# EAGLE schematic Arm controller (EAGLE 9.2.1)
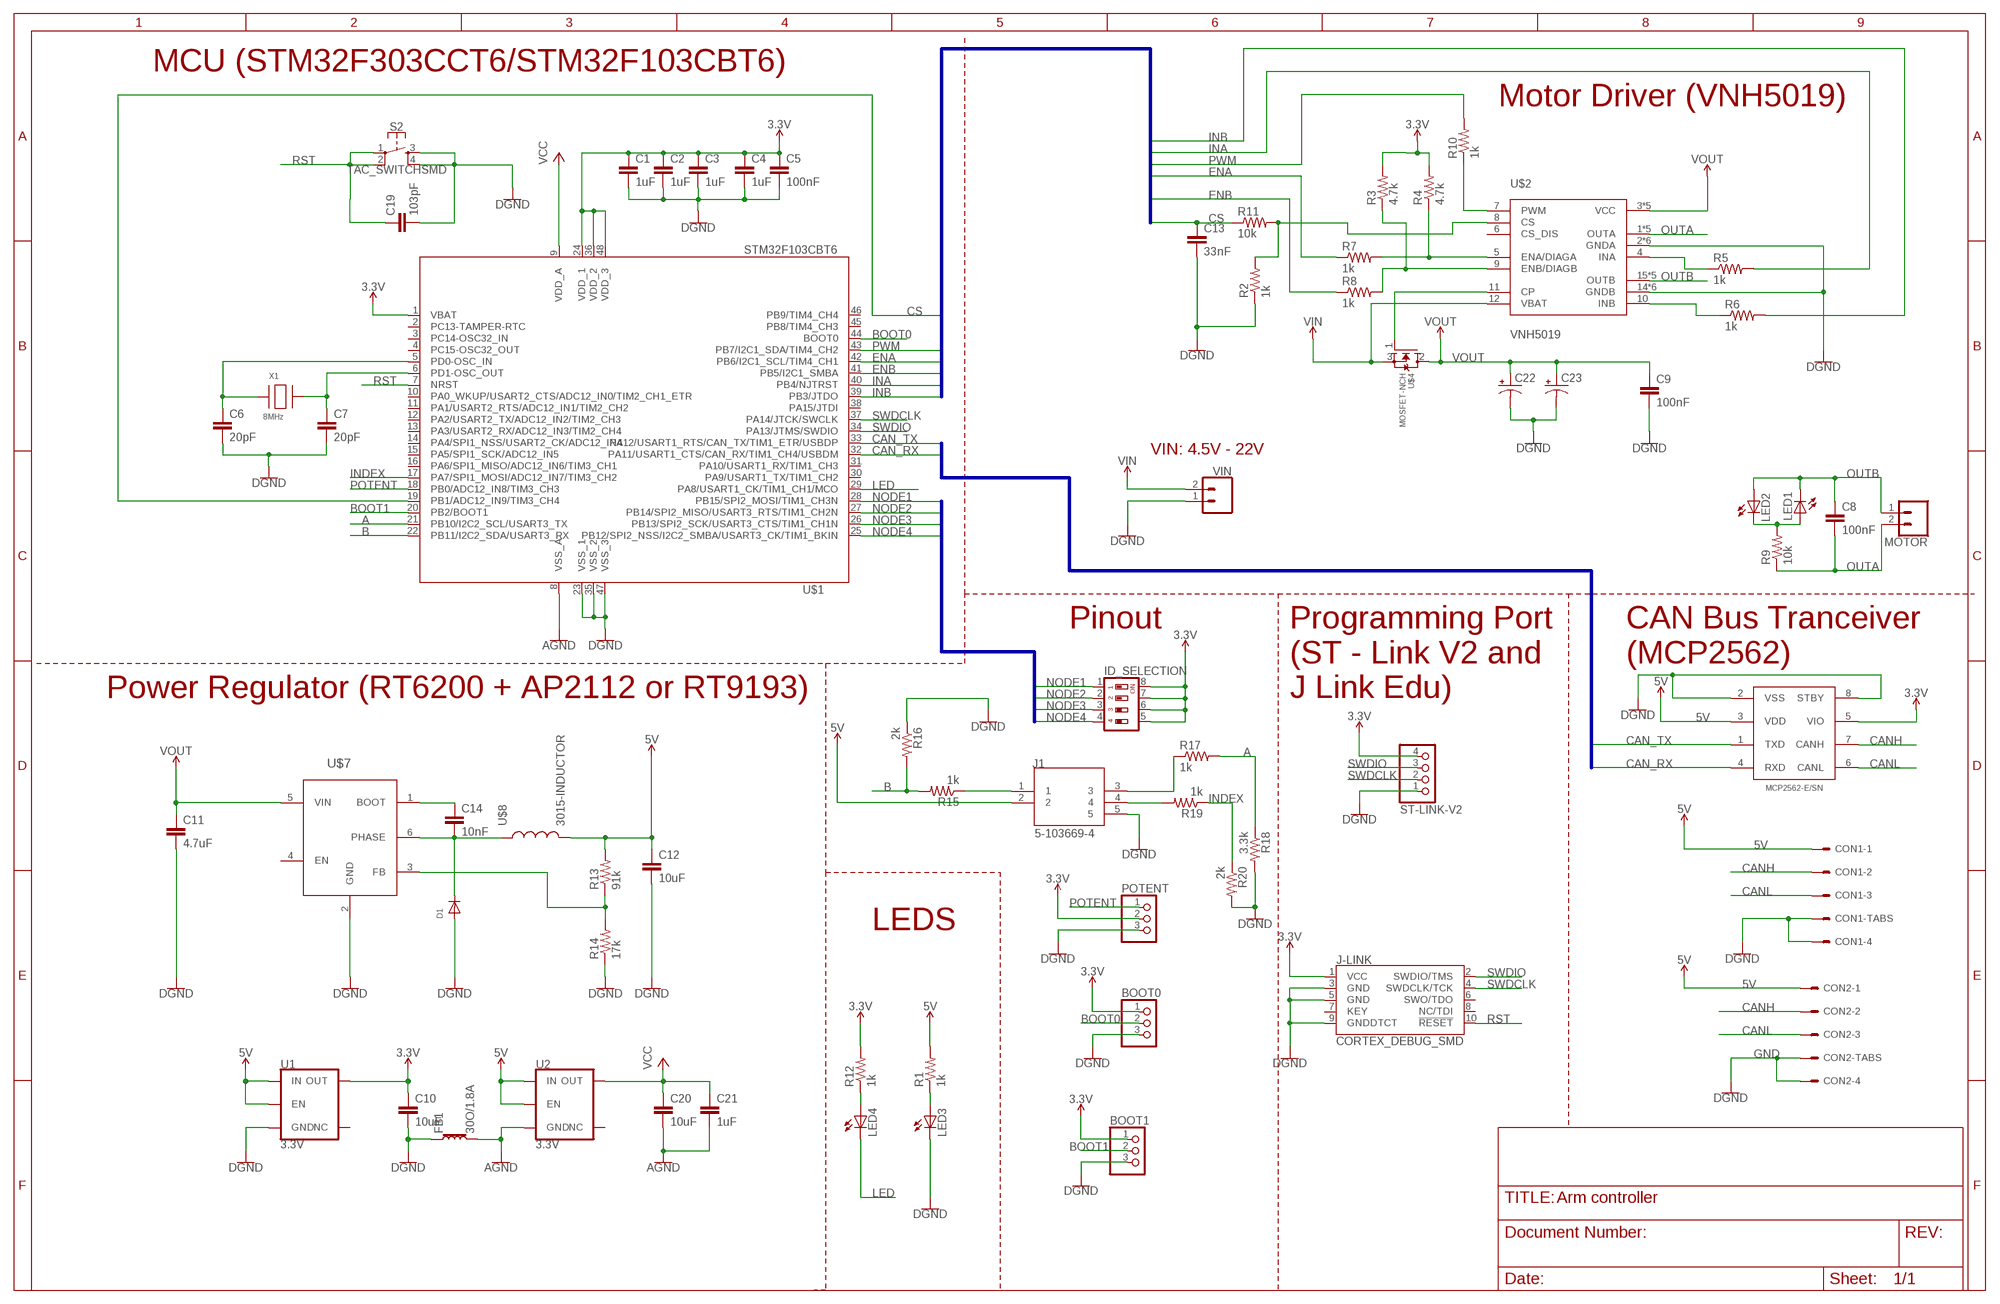
[diagram p0: schematic, sheet 1]

## Parts
BOOT0  PINHD-1X3  [1X03]
BOOT1  PINHD-1X3  [1X03]
C1  1uF  C-EUC0805  [C0805]
C2  1uF  C-EUC0805  [C0805]
C3  1uF  C-EUC0805  [C0805]
C4  1uF  C-EUC0805  [C0805]
C5  100nF  C-EUC0805  [C0805]
C6  20pF  C-EUC0805  [C0805]
C7  20pF  C-EUC0805  [C0805]
C8  100nF  C-EUC1206  [C1206]
C9  100nF  C-EUC0805  [C0805]
C10  10uF  C-EUC1206  [C1206]
C11  4.7uF  C-EUC0805  [C0805]
C12  10uF  C-EUC0805  [C0805]
C13  33nF  C-EUC0805  [C0805]
C14  10nF  C-EUC0805  [C0805]
C19  103pF  C-EUC0805  [C0805]
C20  10uF  C-EUC1206  [C1206]
C21  1uF  C-EUC0805  [C0805]
C22  CPOL-USCT7343  [CT7343]
C23  CPOL-USCT7343  [CT7343]
CON1  SM04B-GHS-TB  [SM04B-GHS-TB]
CON2  SM04B-GHS-TB  [SM04B-GHS-TB]
D1  DIODESOD-123  [SOD-123]
FB1  30O/1.8A  FERRITE_BEAD-0603  [0603]
ID_SELECTION  SMS-004  [SMS-004]
J1  5-103669-4  [TE_5-103669-4]
J-LINK  CORTEX_DEBUG_SMD  [SAMTECH_FTSH-105-01]
LED1  LEDCHIPLED_0805  [CHIPLED_0805]
LED2  LEDCHIPLED_0805  [CHIPLED_0805]
LED3  LEDCHIPLED_0805  [CHIPLED_0805]
LED4  LEDCHIPLED_0805  [CHIPLED_0805]
MOTOR  CONN_025MM  [SCREWTERMINAL-5MM-2]
POTENT  PINHD-1X3  [1X03]
R1  1k  R-US_R0805  [R0805]
R2  1k  R-US_R0805  [R0805]
R3  4.7k  R-US_R0805  [R0805]
R4  4.7k  R-US_R0805  [R0805]
R5  1k  R-US_R0805  [R0805]
R6  1k  R-US_R0805  [R0805]
R7  1k  R-US_R0805  [R0805]
R8  1k  R-US_R0805  [R0805]
R9  10k  R-US_R0805  [R0805]
R10  1k  R-US_R0805  [R0805]
R11  10k  R-US_R0805  [R0805]
R12  1k  R-US_R0805  [R0805]
R13  91k  R-US_R0805  [R0805]
R14  17k  R-US_R0805  [R0805]
R15  1k  R-US_R0805  [R0805]
R16  2k  R-US_R0805  [R0805]
R17  1k  R-US_R0805  [R0805]
R18  3.3k  R-US_R0805  [R0805]
R19  1k  R-US_R0805  [R0805]
R20  2k  R-US_R0805  [R0805]
S2  TAC_SWITCHSMD  MOMENTARY-SWITCH-SPST-2-SMD-5.2MM  [TACTILE_SWITCH_SMD_5.2MM]
ST-LINK-V2  PINHD-1X4  [1X04]
U1  3.3V  V_REG_AP2112K-3.3V  [SOT23-5]
U2  3.3V  V_REG_AP2112K-3.3V  [SOT23-5]
U$1  STM32F103CBT6  [STM32_LQFP48]
U$2  VNH5019  [MULTIPOWERSO-30]
U$3  MCP2562-E/SN  [SOIC8]
U$4  MOSFET-NCH  [TO252-3]
U$7  RT6200  [TSOT23-6]
U$8  3015-INDUCTOR  [3015]
VIN  CONN_025MM  [SCREWTERMINAL-5MM-2]
X1  8MHz  XTALNX5032  [NX5032]

## Nets
1: R4.1 R7.2 U$2.5(ENA/DIAGA)
2: R3.1 R8.2 U$2.9(ENB/DIAGB)
3.3V: BOOT0.1 BOOT1.1 C1.1 C2.1 C3.1 C4.1 C5.1 C10.1 ID_SELECTION.5 ID_SELECTION.6 ID_SELECTION.7 ID_SELECTION.8 J-LINK.1(VCC) POTENT.2 R3.2 R4.2 R12.2 ST-LINK-V2.4 U1.5(OUT) U$1.1(VBAT) U$1.24(VDD_1) U$1.36(VDD_2) U$1.48(VDD_3) U$3.5(VIO)
5V: C12.1 CON1.P$1 CON2.P$1 J1.2 R1.2 R13.2 U1.1(IN) U1.3(EN) U2.1(IN) U2.3(EN) U$3.3(VDD) U$8.2
A: R17.2 R18.1 U$1.21(PB10/I2C2_SCL/USART3_TX)
AGND: C20.2 C21.2 FB1.2 U2.2(GND) U$1.8(VSS_A)
B: R15.2 R16.2 U$1.22(PB11/I2C2_SDA/USART3_RX)
BOOT0: BOOT0.2 U$1.44(BOOT0)
BOOT1: BOOT1.2 U$1.20(PB2/BOOT1)
CAN_RX: U$1.32(PA11/USART1_CTS/CAN_RX/TIM1_CH4/USBDM) U$3.4(RXD)
CAN_TX: U$1.33(PA12/USART1_RTS/CAN_TX/TIM1_ETR/USBDP) U$3.1(TXD)
CANH: CON1.P$2 CON2.P$2 U$3.7(CANH)
CANL: CON1.P$3 CON2.P$3 U$3.6(CANL)
CS: C13.1 R11.1 U$1.19(PB1/ADC12_IN9/TIM3_CH4)
ENA: R7.1 U$1.42(PB6/I2C1_SCL/TIM4_CH1)
ENB: R8.1 U$1.41(PB5/I2C1_SMBA)
GND: BOOT0.3 BOOT1.3 C1.2 C2.2 C3.2 C4.2 C5.2 C6.2 C7.2 C9.2 C10.2 C11.2 C12.2 C13.2 C19.2 C22.- C23.- CON1.P$4 CON1.P$5 CON1.P$6 CON2.P$4 CON2.P$5 CON2.P$6 D1.A FB1.1 J1.5 J-LINK.3(GND) J-LINK.5(GND) J-LINK.9(GNDDTCT) LED3.C POTENT.3 R2.1 R14.1 R16.1 R18.2 R20.2 S2.3 S2.4 ST-LINK-V2.1 U1.2(GND) U$1.23(VSS_1) U$1.35(VSS_2) U$1.47(VSS_3) U$2.2(GNDA) U$2.14(GNDB) U$2.17(GNDB) U$2.18(GNDB) U$2.19(GNDB) U$2.20(GNDB) U$2.22(GNDA) U$2.24(GNDB) U$2.26(GNDA) U$2.27(GNDA) U$2.28(GNDA) U$2.29(GNDA) U$3.2(VSS) U$3.8(STBY) U$7.2(GND) VIN.1 ; supply symbol labelled DGND
INA: R5.2 U$1.40(PB4/NJTRST)
INB: R6.2 U$1.39(PB3/JTDO)
INDEX: R19.1 R20.1 U$1.17(PA7/SPI1_MOSI/ADC12_IN7/TIM3_CH2)
LED: LED4.C U$1.29(PA8/USART1_CK/TIM1_CH1/MCO)
N$1: C6.1 U$1.5(PD0-OSC_IN) X1.P$1
N$2: C7.1 U$1.6(PD1-OSC_OUT) X1.P$2
N$3: LED1.A LED2.C R9.2
N$4: C14.1 U$7.1(BOOT)
N$5: LED4.A R12.1
N$6: C14.2 D1.C U$7.6(PHASE) U$8.1
N$7: J1.1 R15.1
N$8: R13.1 R14.2 U$7.3(FB)
N$9: R5.1 U$2.4(INA)
N$10: R2.2 R11.2 U$2.8(CS)
N$11: J1.3 R17.1
N$12: R6.1 U$2.10(INB)
N$14: U$2.11(CP) U$4.1(G)
N$15: J1.4 R19.2
N$20: R10.1 U$2.7(PWM)
N$22: LED3.A R1.1
NODE1: ID_SELECTION.1 U$1.28(PB15/SPI2_MOSI/TIM1_CH3N)
NODE2: ID_SELECTION.2 U$1.27(PB14/SPI2_MISO/USART3_RTS/TIM1_CH2N)
NODE3: ID_SELECTION.3 U$1.26(PB13/SPI2_SCK/USART3_CTS/TIM1_CH1N)
NODE4: ID_SELECTION.4 U$1.25(PB12/SPI2_NSS/I2C2_SMBA/USART3_CK/TIM1_BKIN)
OUTA: C8.2 MOTOR.2 R9.1 U$2.1(OUTA) U$2.25(OUTA) U$2.30(OUTA) U$2.OUTA U$2.OUTA@1(OUTA)
OUTB: C8.1 LED1.C LED2.A MOTOR.1 U$2.15(OUTB) U$2.16(OUTB) U$2.21(OUTB) U$2.OUTB U$2.OUTB@1(OUTB)
POTENT: POTENT.1 U$1.18(PB0/ADC12_IN8/TIM3_CH3)
PWM: R10.2 U$1.43(PB7/I2C1_SDA/TIM4_CH2)
RST: C19.1 J-LINK.10(!RESET) S2.1 S2.2 U$1.7(NRST)
SWDCLK: J-LINK.4(SWDCLK/TCK) ST-LINK-V2.2 U$1.37(PA14/JTCK/SWCLK)
SWDIO: J-LINK.2(SWDIO/TMS) ST-LINK-V2.3 U$1.34(PA13/JTMS/SWDIO)
VCC: C20.1 C21.1 U2.5(OUT) U$1.9(VDD_A)
VIN: U$2.12(VBAT) U$4.3(S) VIN.2
VOUT: C9.1 C11.1 C22.+ C23.+ U$2.3(VCC) U$2.13(VCC) U$2.23(VCC) U$2.VCC U$2.VCC@1(VCC) U$4.2(D) U$7.5(VIN)
Unconnected: J-LINK.6(SWO/TDO) J-LINK.7(KEY) J-LINK.8(NC/TDI) U1.4(NC) U2.4(NC) U$1.2(PC13-TAMPER-RTC) U$1.3(PC14-OSC32_IN) U$1.4(PC15-OSC32_OUT) U$1.10(PA0_WKUP/USART2_CTS/ADC12_IN0/TIM2_CH1_ETR) U$1.11(PA1/USART2_RTS/ADC12_IN1/TIM2_CH2) U$1.12(PA2/USART2_TX/ADC12_IN2/TIM2_CH3) U$1.13(PA3/USART2_RX/ADC12_IN3/TIM2_CH4) U$1.14(PA4/SPI1_NSS/USART2_CK/ADC12_IN4) U$1.15(PA5/SPI1_SCK/ADC12_IN5) U$1.16(PA6/SPI1_MISO/ADC12_IN6/TIM3_CH1) U$1.30(PA9/USART1_TX/TIM1_CH2) U$1.31(PA10/USART1_RX/TIM1_CH3) U$1.38(PA15/JTDI) U$1.45(PB8/TIM4_CH3) U$1.46(PB9/TIM4_CH4) U$2.6(CS_DIS) U$7.4(EN)

## Buses
CS,ENA,ENB,INA,INB,PWM
NODE1,NODE2,NODE3,NODE4
CAN_RX,CAN_TX

## Notes on the sheet
- MCU (STM32F303CCT6/STM32F103CBT6)
- Motor Driver (VNH5019)
- VIN: 4.5V - 22V
- Pinout
- CAN Bus Tranceiver
  (MCP2562)
- Power Regulator (RT6200 + AP2112 or RT9193)
- Programming Port
  (ST - Link V2 and 
  J Link Edu)
- LEDS

## Library data of the parts
BOOT0 BOOT1 POTENT = pinhead:PINHD-1X3: PIN HEADER
C1-C7 C9 C11-C14 C19 C21 = rcl:C-EU: CAPACITOR, European symbol; SPICEPREFIX: C
C8 C10 C20 = resistor:C-EU: CAPACITOR, European symbol
C22 C23 = rcl:CPOL-US: POLARIZED CAPACITOR, American symbol; SPICEPREFIX: C
CON1 CON2 = SPEAR:SM04B-GHS-TB
D1 = adafruit:DIODE: Diode SMADIODE - SMA Surface Mount Package 20V 1A Schottky Diode Digikey: 641-1014-6-ND DO-1N4148 - Through Hole Small Current Diode SOD-123 20V 1 A (.5mV Vf) Schottky Diode - Digikey: MBRX120TPMSCT-ND SOD-323 10V 570mA (.38mV Vf, 3ns) Schottky Diode - Digikey: ZLLS410CT-ND SOD-523 30V 30mA Schottky Diode (RB751S-40TE61) - Digikey: RB751S-40TE61CT-ND SOT23-R/W - SOT23 Package (R = Solder Paste/Reflow Ovens, W = Hand-Soldering) BAT54Film 40V 300mA - Digikey: 497-7162-1-ND
FB1 = SPEAR:FERRITE_BEAD: Ferrite Bead (blocks, cores, rings, chokes, etc.) Inductor with layers of ferrite used to suppress high frequencies. Often used to isolate high frequency noise. SparkFun Products: IOIO-OTG - V2.2 <https://www.sparkfun.com/products/13613> SparkFun SAMD21 Mini Breakout <https://www.sparkfun.com/products/13664> SparkFun 6 Degrees of Freedom Breakout - LSM6DS3 <https://www.sparkfun.com/products/13339> SparkFun SAMD21 Dev Breakout <https://www.sparkfun.com/products/13672>; PROD_ID: NDUC-13805
ID_SELECTION = SPEAR:SMS-004
J1 = SPEAR:5-103669-4: 05 MTE HDR SRST LATCH W/HLDWN; AVAILABILITY: Unavailable; CENTERLINE_PITCH: 2.54 mm[.1 in]; COMMENT: 5-103669-4; DESCRIPTION: 05 MTE HDR SRST LATCH W/HLDWN; EU_ROHS_COMPLIANCE: Compliant; LINK: http://www.te.com/usa-en/product-5-103669-4.html; MF: TE Connectivity; MP: 5-103669-4; NUMBER_OF_POSITIONS: 5; PACKAGE: None; PRICE: None; PRODUCT_TYPE: Connector
J-LINK = SparkFun-Connectors:CORTEX_DEBUG: Cortex Debug Connector - 10 pin Supports JTAG debug, Serial Wire debug, and Serial Wire Viewer. PTH and SMD connector options available. General Connector Information <http://infocenter.arm.com/help/topic/com.arm.doc.faqs/attached/13634/cortex_debug_connectors.pdf> Products: PTH Connector <http://www.digikey.com/product-detail/en/cnc-tech/3220-10-0100-00/1175-1627-ND/3883661> -via Digi-Key SparkFun PSoc <https://www.sparkfun.com/products/13229> SparkFun T <https://www.sparkfun.com/products/13810>
LED1-LED4 = led:LED: LED OSRAM: - CHIPLED LG R971, LG N971, LY N971, LG Q971, LY Q971, LO R971, LY R971 LH N974, LH R974 LS Q976, LO Q976, LY Q976 LO Q996 - Hyper CHIPLED LW Q18S LB Q993, LB Q99A, LB R99A - SideLED LS A670, LO A670, LY A670, LG A670, LP A670 LB A673, LV A673, LT A673, LW A673 LH A674 LY A675 LS A676, LA A676, LO A676, LY A676, LW A676 LS A679, LY A679, LG A679 - Hyper Micro SIDELED® LS Y876, LA Y876, LO Y876, LY Y876 LT Y87S - SmartLED LW L88C, LW L88S LB L89C, LB L89S, LG L890 LS L89K, LO L89K, LY L89K LS L896, LA L896, LO L896, LY L896 - TOPLED LS T670, LO T670, LY T670, LG T670, LP T670 LSG T670, LSP T670, LSY T670, LOP T670, LYG T670 LG T671, LOG T671, LSG T671 LB T673, LV T673, LT T673, LW T673 LH T674 LS T676, LA T676, LO T676, LY T676, LB T676, LH T676, LSB T676, LW T676 LB T67C, LV T67C, LT T67C, LS T67K, LO T67K, LY T67K, LW E67C LS E67B, LA E67B, LO E67B, LY E67B, LB E67C, LV E67C, LT E67C LW T67C LS T679, LY T679, LG T679 LS T770, LO T770, LY T770, LG T770, LP T770 LB T773, LV T773, LT T773, LW T773 LH T774 LS E675, LA E675, LY E675, LS T675 LS T776, LA T776, LO T776, LY T776, LB T776 LHGB T686 LT T68C, LB T68C - Hyper Mini TOPLED® LB M676 - Mini TOPLED Santana® LG M470 LS M47K, LO M47K, LY M47K Source: http://www.osram.convergy.de LUXEON: - LUMILED® LXK2-PW12-R00, LXK2-PW12-S00, LXK2-PW14-U00, LXK2-PW14-V00 LXK2-PM12-R00, LXK2-PM12-S00, LXK2-PM14-U00 LXK2-PE12-Q00, LXK2-PE12-R00, LXK2-PE12-S00, LXK2-PE14-T00, LXK2-PE14-U00 LXK2-PB12-K00, LXK2-PB12-L00, LXK2-PB12-M00, LXK2-PB14-N00, LXK2-PB14-P00, LXK2-PB14-Q00 LXK2-PR12-L00, LXK2-PR12-M00, LXK2-PR14-Q00, LXK2-PR14-R00 LXK2-PD12-Q00, LXK2-PD12-R00, LXK2-PD12-S00 LXK2-PH12-R00, LXK2-PH12-S00 LXK2-PL12-P00, LXK2-PL12-Q00, LXK2-PL12-R00 Source: www.luxeon.com KINGBRIGHT: KA-3528ASYC Source: www.kingbright.com
MOTOR VIN = SparkFun-Connectors:CONN_02: Multi connection point. Often used as Generic Header-pin footprint for 0.1 inch spaced/style header connections On any of the 0.1 inch spaced packages, you can populate with these: Break Away Headers - Straight <https://www.sparkfun.com/products/116> (PRT-00116) Break Away Male Headers - Right Angle <https://www.sparkfun.com/products/553> (PRT-00553) Female Headers <https://www.sparkfun.com/products/115> (PRT-00115) Break Away Headers - Machine Pin <https://www.sparkfun.com/products/117> (PRT-00117) Break Away Female Headers - Swiss Machine Pin <https://www.sparkfun.com/products/743> (PRT-00743) For SCREWTERMINALS and SPRING TERMINALS visit here: Screw Terimnals on SparkFun.com <https://www.sparkfun.com/search/results?term=Screw+Terminals> (5mm/3.5mm/2.54mm spacing) This device is also useful as a general connection point to wire up your design to another part of your project. Our various solder wires solder well into these plated through hole pads. Hook-Up Wire - Assortment (Stranded, 22 AWG) <https://www.sparkfun.com/products/11375> (PRT-11375) Hook-Up Wire - Assortment (Solid Core, 22 AWG) <https://www.sparkfun.com/products/11367> (PRT-11367) View the entire wire category on our website here <https://www.sparkfun.com/categories/141> Special notes: Molex polarized connector foot print use with: PRT-08233 with associated crimp pins and housings. 2.54_SCREWTERM for use with PRT-10571. 3.5mm Screw Terminal footprints for PRT-08084 5mm Screw Terminal footprints for use with PRT-08432; SF_SKU: PRT-08432
R1-R20 = rcl:R-US_: RESISTOR, American symbol; SPICEPREFIX: R
S2 = SPEAR:MOMENTARY-SWITCH-SPST-2: Momentary Switch (Pushbutton) - SPST - Two Circuits Normally-open (NO) SPST momentary switches (buttons, pushbuttons). Schematic symbol includes two switch circuits. Variants SMD-4.6MMX2.8MM - 4.60mm x 2.80mm Tactile Momentary Button Switch - Used on SparkFun SAMD21 Mini Breakout <https://www.sparkfun.com/products/13664> SMD-5.2MM - Mini Pushbutton Switch - SMD <https://www.sparkfun.com/products/8720> - Used on Arduino Pro Mini <https://www.sparkfun.com/products/11114>; PROD_ID: SWCH-08247; SF_SKU: COM-08720
ST-LINK-V2 = pinhead:PINHD-1X4: PIN HEADER
U1 U2 = SparkFun-IC-Power:V_REG_AP2112: AP2112 - 600mA CMOS LDO Regulator w/ Enable The AP2112 is CMOS process low dropout linear regulator with enable function, the regulator delivers a guaranteed 600mA (min.) continuous load current. Features Output Voltage Accuracy: ±1.5% Output Current: 600mA (Min.) Foldback Short Current Protection: 50mA Enable Function to Turn ON/OFF VOUT Low Dropout Voltage (3.3V): 250mV (Typ.) @IOUT=600mA Excellent Load Regulation: 0.2%/A (Typ.) Excellent Line Regulation: 0.02%/V (Typ.) Low Quiescent Current: 55μA (Typ.) Low Standby Current: 0.01μA (Typ.) Low Output Noise: 50μVRMS PSRR: 100Hz -65dB, 1kHz -65dB OTSD Protection Stable with 1.0μF Flexible Cap: Ceramic, Tantalum and Aluminum Electrolytic Operation Temperature Range: -40°C to 85°C ESD: MM 400V, HBM 4000V; PROD_ID: VREG-12457
U$1 = SPEAR:STM32F103CBT6
U$2 = SPEAR:VNH5019: The VHN5019A-E is a full bridge motor driver intended for a wide range of automotive applications. The device incorporates a dual monolithic high-side drivers and two low-side switches. The high-side driver switch is designed using STMicroelectronics’ well known and proven proprietary VIPower® M0 technology that allows to efficiently integrate on the same die a true Power MOSFET with an intelligent signal/protection circuit.
U$3 = SPEAR:MCP2562-E/SN
U$4 = SPEAR:MOSFET-NCH: N-Channel MOSFET like the IPB80N03S4L-03.
U$7 = SPEAR:RT6200
U$8 = LCSC:3015-INDUCTOR
X1 = adafruit:XTAL: Low cost SMT crystals, no capacitors included http://www.ladyada.net/library/eagle